# EAGLE design Gleichrichter-Optokoppler (EAGLE 6.6.0)
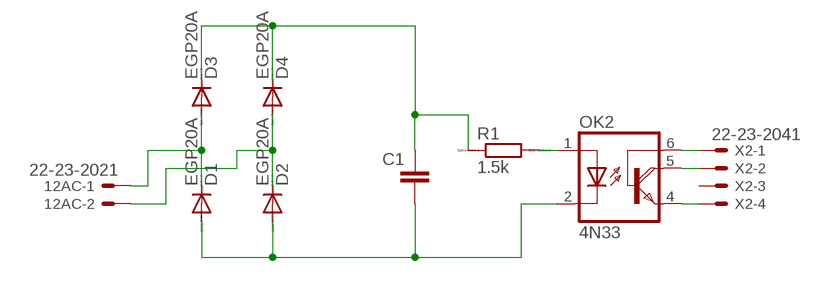
[diagram p0: schematic, sheet 1]

## Parts
12AC  22-23-2021  [22-23-2021]
C1  C5/4.5  [C5B4.5]
D1  EGP20A  [DO15-12]
D2  EGP20A  [DO15-12]
D3  EGP20A  [DO15-12]
D4  EGP20A  [DO15-12]
OK2  4N33  [DIL06]
R1  1.5k  R0207/10  [0207/10]
X2  22-23-2041  [22-23-2041]

## Nets
N$1: 12AC.1 D1.C D3.A
N$2: 12AC.2 D2.C D4.A
N$3: C1.2 D1.A D2.A OK2.2(C)
N$4: C1.1 D3.C D4.C R1.1
N$5: OK2.1(A) R1.2
N$6: OK2.6(B) X2.1
N$7: OK2.5(COL) X2.2
N$8: OK2.4(E) X2.4
Unconnected: X2.3

## Library data of the parts
12AC = con-molex:22-23-2021: .100" (2.54mm) Center Header - 2 Pin; MF: MOLEX; MPN: 22-23-2021; OC_FARNELL: 1462926; OC_NEWARK: 25C3832
C1 = capacitor-wima:C: CAPACITOR naming: grid - package width
D1-D4 = diode:EGP20A: DIODE ultra fast-recovery rectifier
OK2 = optocoupler:4N33: MOTOROLA OPTO COUPLER; MF: VISHAY/TELEFUNKEN; MPN: 4N33; OC_FARNELL: 1469601; OC_NEWARK: 88K1390
R1 = eagle-ltspice:R: RESISTOR, European symbol; SPICEMODEL: NONE; SPICEPREFIX: R
X2 = con-molex:22-23-2041: .100" (2.54mm) Center Header - 4 Pin; MF: MOLEX; MPN: 22-23-2041; OC_FARNELL: 1462920; OC_NEWARK: 38C0355

## Board
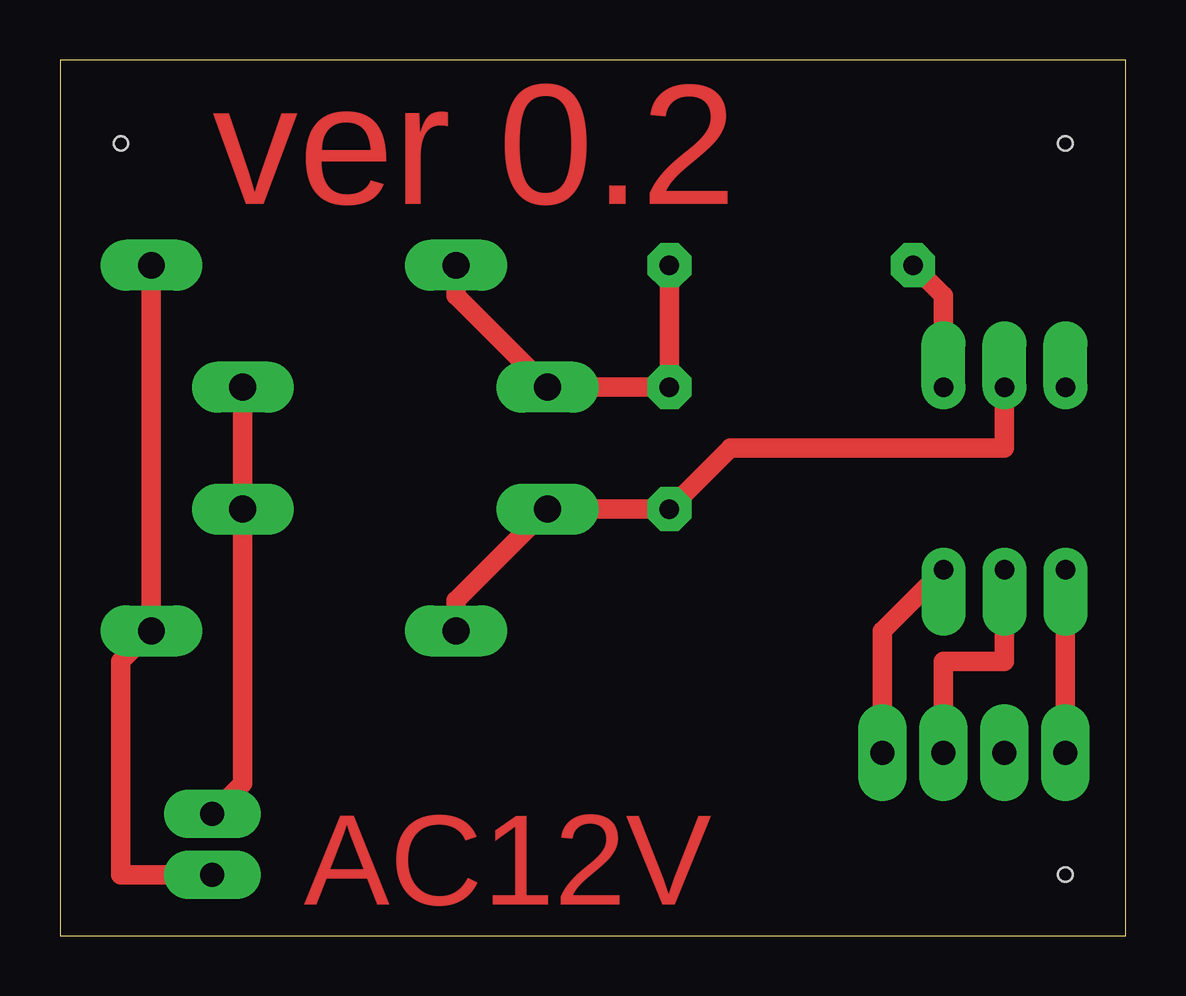
[diagram p1: board, top side]
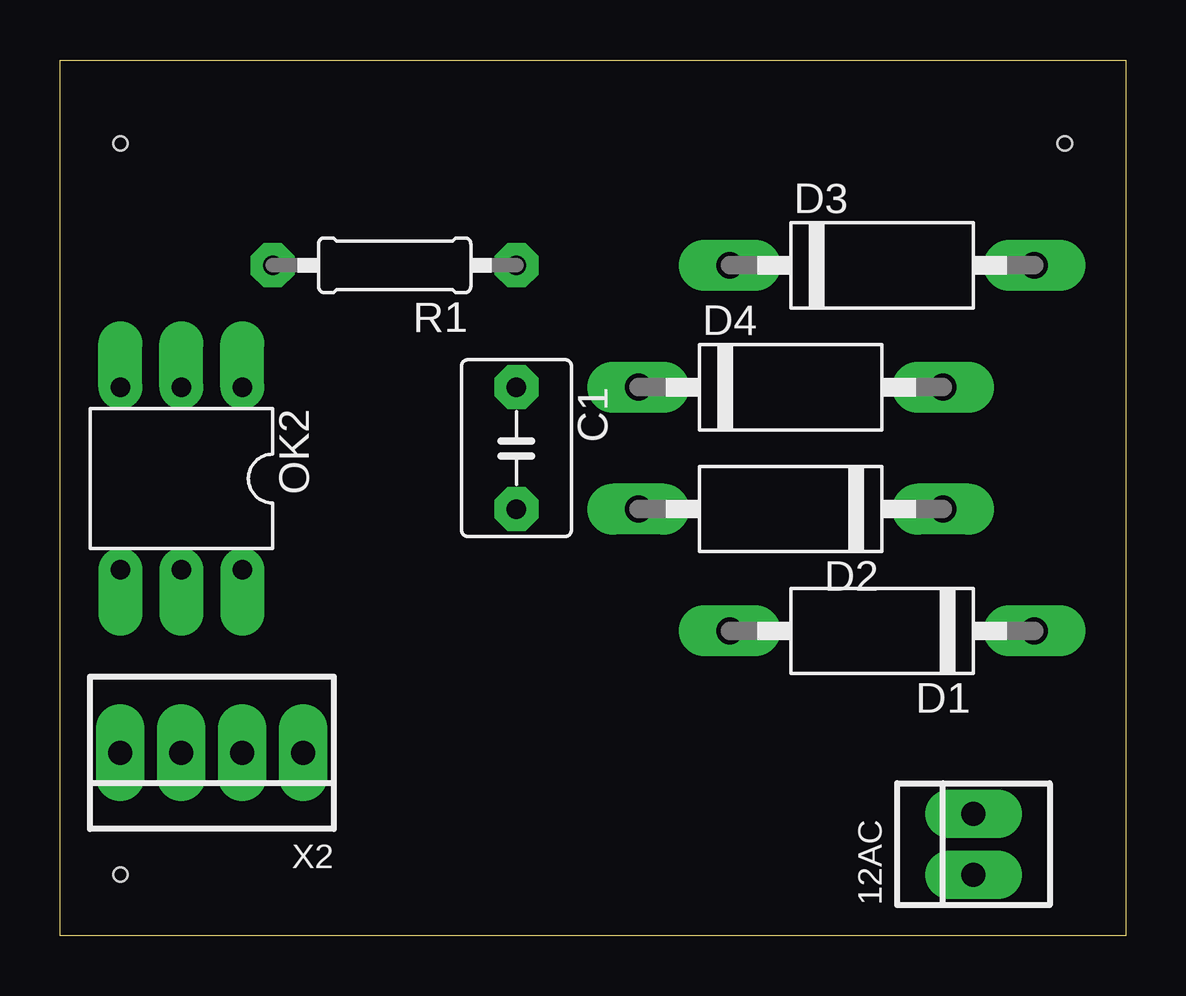
[diagram p2: board, bottom side, seen from below]

Size 44.43 x 36.5 mm. Coordinates in mm from the lower left corner, seen from the top.
Outline: 0,0 44.43,0 44.43,36.5 0,36.5 0,0
Copper layers (1*16): Top 0.035mm / dielectric 1.5mm / Bottom 0.035mm
Design rules "default *": minimum track width 10mil, minimum drill 24mil, track to track 8mil, track to pad 8mil, pad to pad 8mil, via to via 8mil, smd to smd 8mil, copper to edge 40mil, drill to drill 8mil, minimum pad ring 20mil, minimum via ring 20mil, stop-mask expansion 4mil, vias tented up to drill 0mil, thermal gap 10mil
Holes 0.6 mm at 41.91,33.02 41.91,2.54 2.54,33.02

### Footprints (pad centres in the part's own frame; a part is rotated, then mirrored left to right if it is on the bottom)
22-23-2021 = drill 1 long: 1 -1.27,0; 2 1.27,0
C5B4.5 = drill 0.813 pad 1.6 octagon: 1 -2.54,0; 2 2.54,0
DO15-12 = drill 1.118 long: A 6.35,0; C -6.35,0
DIL06 = drill 0.813 offset: 1 -2.54,-3.81; 2 0,-3.81; 3 2.54,-3.81; 4 2.54,3.81; 5 0,3.81; 6 -2.54,3.81
0207/10 = drill 0.813 octagon: 1 -5.08,0; 2 5.08,0
22-23-2041 = drill 1 long: 1 -3.81,0; 2 -1.27,0; 3 1.27,0; 4 3.81,0

### Placement (x,y rotation side)
12AC  6.35,3.81 90 bottom
C1  25.4,20.32 270 bottom
D1  10.16,12.7 180 bottom
D2  13.97,17.78 180 bottom
D3  10.16,27.94 0 bottom
D4  13.97,22.86 0 bottom
OK2  39.37,19.05 180 bottom
R1  30.48,27.94 180 bottom
X2  38.1,7.62 180 bottom

### Tracks (layer width: path | path; a pad name or v marks a point on that pad's centre or on a via)
N$1
  Top 0.813: 12AC.1 2.54,2.54 2.54,11.43 D1.C D3.A
N$2
  Top 0.813: D4.A D2.C 7.62,6.35 12AC.2
N$3
  Top 0.813: D1.A 16.51,13.97 D2.A C1.2 27.94,20.32 39.37,20.32 OK2.2
N$4
  Top 0.813: D3.C 16.51,26.67 D4.C C1.1 R1.1
N$5
  Top 0.813: R1.2 36.83,26.67 OK2.1
N$6
  Top 0.813: OK2.6 34.29,12.7 X2.1
N$7
  Top 0.813: X2.2 36.83,11.43 39.37,11.43 OK2.5
N$8
  Top 0.813: X2.4 OK2.4

### Text on the board
Top: ver 0.2 | AC12V